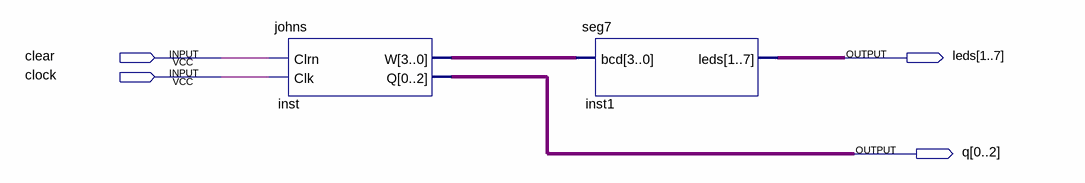
[diagram p0: schematic sheet]
// Quartus schematic johns1.bdf as structural Verilog: 2 symbols, 4 pins
module johns1 (
  input  clear,
  input  clock,
  output [1:7] leds,
  output [0:2] q
);

  wire [3:0] inst_w;

  johns inst (.Clrn(clear), .Clk(clock), .W(inst_w), .Q(q));
  seg7 inst1 (.bcd(inst_w), .leds(leds));
endmodule
